# Altium project Back_Lite.PrjPcb
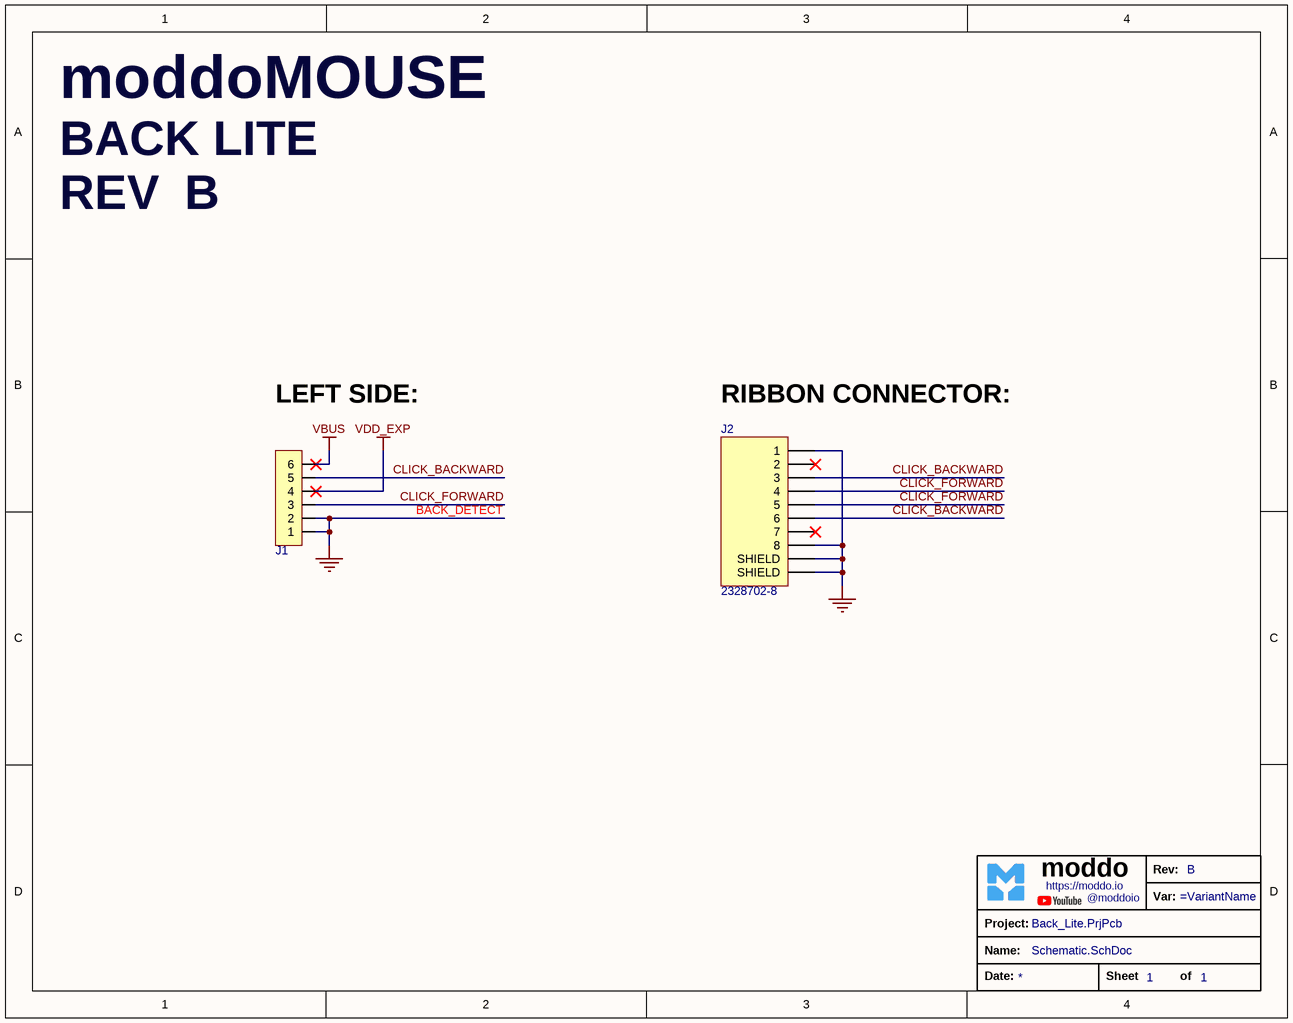
[diagram p0: Schematic.SchDoc]
Revision: B
1 sheet, 3 parts. Net scope: global (net labels, ports and power ports of the same name join across sheets).
Board files: PCB.PcbDoc, PcbPanel.PcbDoc

## Sheet Schematic.SchDoc
size A; SheetNumber: 1; SheetTotal: 1

### Parts
?  TitleBlock_moddo  (value not drawn)  (graphical)
J1  1.27mm_6pins  [1.27mm_6pins_MaleHeader_RightAngle]  (value not drawn)
J2  2328702-8  [2328702-8]

### Nets
GND: J1.1 J1.2 J2.1 J2.8 J2.S1(SHIELD) J2.S2(SHIELD)
VBUS: J1.6
VDD_EXP: J1.4
CLICK_BACKWARD: J1.5 J2.3 J2.6
CLICK_FORWARD: J1.3 J2.4 J2.5

Not connected (* = marked no-connect by the designer): J2 2* 7*

### Notes on the sheet
- moddoMOUSE <https://protorig.io/>
- BACK LITE <https://protorig.io/>
- REV
- LEFT SIDE:
- (near J2) RIBBON CONNECTOR:
- BACK_DETECT
- (in symbol TitleBlock_moddo) Rev:; moddo; https://moddo.io; Var:; @moddoio; Project:; Name:; Date:; Sheet; of

### Library data of the parts
J1 = 1.27mm_6pins_male_rightangle: Pin Header 6 Position 1.27mm Pitch Single Row Through Hole, Right Angle -40℃~+105℃; Manufacturer Part Number: 1271WR-6P; Manufacturer: HanElectricity
J2 = 2328702-8: FFC/FPC Connector, 8 Contact(s), 1 Row(s), Right Angle, Solder Terminal, Natural Insulator; Manufacturer: TE Connectivity; Actuator Material: Thermoplastic; Actuator Color: Black; Plating: Gold; Number of Positions: 8; Voltage Rating: 50V; Connector System: Wire-to-Board; Gender: Receptacle; Sealable: No (Without); Supplier 1: Arrow Electronics; Manufacturer Part Number: 2328702-8; RoHS: Yes; Category: FFC / FPC; Stock 1: 56000; Pricing 1: 28000=0.0961 (USD); Mounting Technology: Surface Mount; Contact Material: Copper Alloy; Contact Plating: Gold; Housing Material: Thermoplastic; Housing Color: Natural; Min Operating Temperature: -40°C; Max Operating Temperature: 85°C; Packaging: Cut Tape; Termination: Solder; Series: -; Number of Contacts: 8; Number of Rows: 1; Operating Supply Voltage: 50V; Orientation: Right Angle; Length: 6mm; Height: 1mm; Flammability Rating: UL94 V-0; ComponentLink1URL: https://www.te.com/commerce/DocumentDelivery/DDEController?Action=srchrtrv&amp;DocNm=2328702&amp;DocType=Customer+Drawing&amp;DocLang=English&src-supplier=Digikey; ComponentLink1Description: https://www.te.com/commerce/DocumentDelivery/DDEController?Action=srchrtrv&amp;DocNm=2328702&amp;DocType=Customer+Drawing&amp;DocLang=English&src-supplier=Digikey; Supplier Part Number 1: 2328702-8

## Assembly variants
Main: all parts fitted